# Altium schematic sheet FOTA.SchDoc: FOTA
size 292 x 193 mm; SheetNumber: 21; SheetTotal: 28
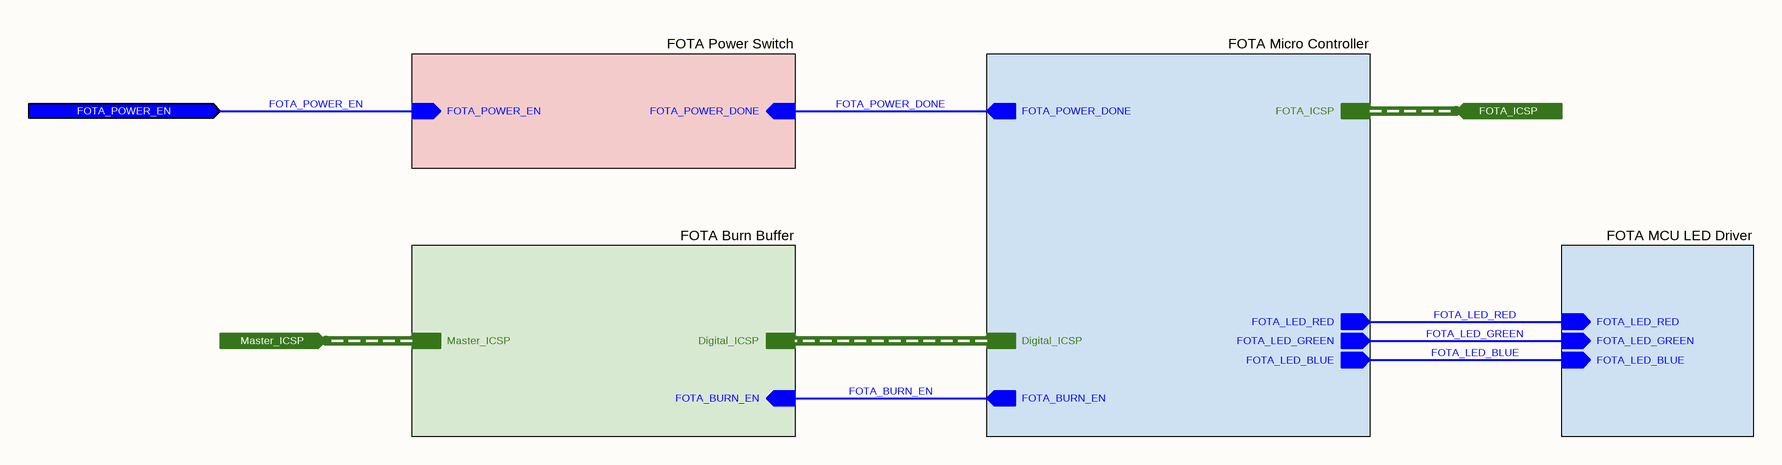
[diagram p0: FOTA.SchDoc]

## Sub-sheets
FOTA Burn Buffer = FOTA Burn Buffer.SchDoc: Digital_ICSP (harness Digital_ICSP), FOTA_BURN_EN (in), Master_ICSP (harness Master_ICSP)
FOTA MCU LED Driver = FOTA LED Driver.SchDoc: FOTA_LED_RED (in), FOTA_LED_BLUE (in), FOTA_LED_GREEN (in)
FOTA Micro Controller = FOTA Micro Controller.SchDoc: FOTA_BURN_EN (out), FOTA_POWER_DONE (out), FOTA_LED_RED (out), FOTA_LED_GREEN (out), FOTA_LED_BLUE (out), Digital_ICSP (harness Digital_ICSP), FOTA_ICSP (harness FOTA_ICSP)
FOTA Power Switch = FOTA Microcontroller Power Switch.SchDoc: FOTA_POWER_DONE (in), FOTA_POWER_EN (in)

## Ports
FOTA_ICSP (in, harness FOTA_ICSP), FOTA_POWER_EN (in), Master_ICSP (in, harness Master_ICSP)

## Nets
FOTA_BURN_EN: sheet FOTA Micro Controller/FOTA_BURN_EN, sheet FOTA Burn Buffer/FOTA_BURN_EN
FOTA_LED_BLUE: sheet FOTA MCU LED Driver/FOTA_LED_BLUE, sheet FOTA Micro Controller/FOTA_LED_BLUE
FOTA_LED_GREEN: sheet FOTA MCU LED Driver/FOTA_LED_GREEN, sheet FOTA Micro Controller/FOTA_LED_GREEN
FOTA_LED_RED: sheet FOTA MCU LED Driver/FOTA_LED_RED, sheet FOTA Micro Controller/FOTA_LED_RED
FOTA_POWER_DONE: sheet FOTA Power Switch/FOTA_POWER_DONE, sheet FOTA Micro Controller/FOTA_POWER_DONE
FOTA_POWER_EN: port FOTA_POWER_EN, sheet FOTA Power Switch/FOTA_POWER_EN

## Buses and harness runs
harness port FOTA_ICSP = sheet FOTA Micro Controller/FOTA_ICSP
harness port Master_ICSP = sheet FOTA Burn Buffer/Master_ICSP
harness sheet FOTA Burn Buffer/Digital_ICSP = sheet FOTA Micro Controller/Digital_ICSP

## Notes on the sheet
- © 2021 All rights reserved.
  This document may not, in whole or in part, be copied, photocopied, reproduced, translated or converted to any electronic or machine readable from without prior written permission of Mehmet Günce Akkoyun.
  Engineer contact : akkoyun@me.com
- Property of
- Engineer :
- Date :
- Size :
- A4
- Time :
- Project :
- Page :
- /
- Customer :
- Product ID :
- Module ID :
- Version :
- File :
- Revision :